# EAGLE design SONOFFPROG (EAGLE 9.4.0)
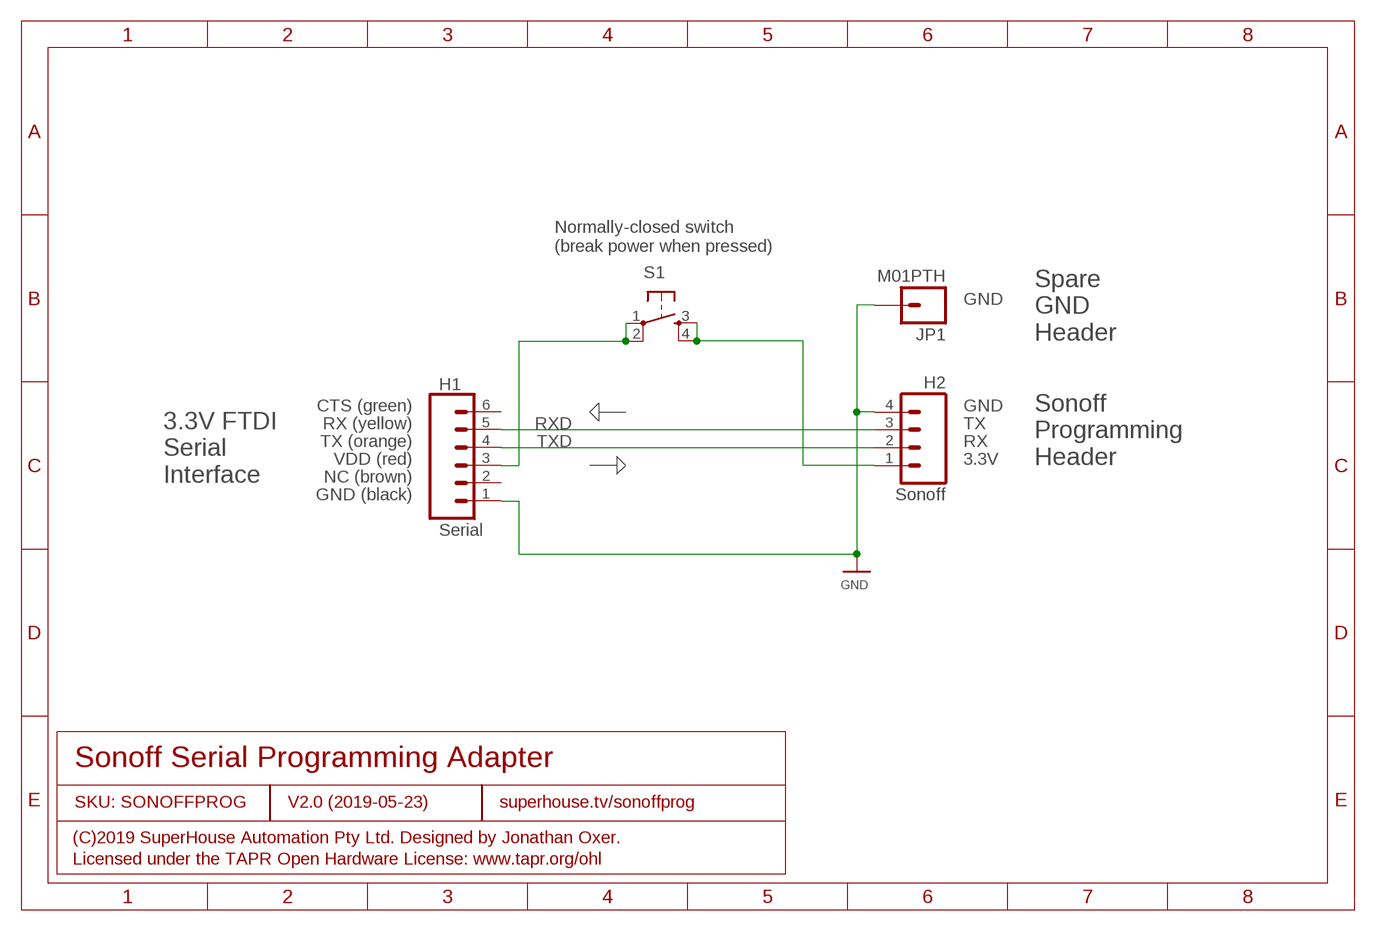
[diagram p0: schematic, sheet 1]

## Parts
H1  Serial  M06SIP  [1X06]
H2  Sonoff  M04PTH  [1X04]
JP1  M01PTH  [1X01]
S1  TAC_SWITCHPTH  [TACTILE-PTH]

## Nets
GND: H1.1 H2.4 JP1.1
N$1: H2.1 S1.3 S1.4
N$4: H1.3 S1.1 S1.2
RXD: H1.5 H2.3
TXD: H1.4 H2.2
Unconnected: H1.2 H1.6

## Notes on the sheet
- Normally-closed switch
  (break power when pressed)
- GND
- Spare
  GND
  Header
- CTS (green) | GND
- RX (yellow) | TX
- TX (orange) | RX
- VDD (red) | 3.3V
- Sonoff
  Programming
  Header
- 3.3V FTDI
  Serial
  Interface
- NC (brown)
- GND (black)
- Sonoff Serial Programming Adapter
- SKU: SONOFFPROG | V2.0 (2019-05-23) | superhouse.tv/sonoffprog
- (C)2019 SuperHouse Automation Pty Ltd. Designed by Jonathan Oxer.
- Licensed under the TAPR Open Hardware License: www.tapr.org/ohl

## Library data of the parts
H1 = freetronics-master-v1:M06: Header 6 Standard 6-pin 0.1" header. Use with straight break away headers (SKU : PRT-00116), right angle break away headers (PRT-00553), swiss pins (PRT-00743), machine pins (PRT-00117), and female headers (PRT-00115). Molex polarized connector foot print use with SKU : PRT-08094 with associated crimp pins and housings. NOTES ON THE VARIANTS LOCK and LOCK_LONGPADS... This footprint was designed to help hold the alignment of a through-hole component (i.e. 6-pin header) while soldering it into place. You may notice that each hole has been shifted either up or down by 0.005 of an inch from it's more standard position (which is a perfectly straight line). This slight alteration caused the pins (the squares in the middle) to touch the edges of the holes. Because they are alternating, it causes a "brace" to hold the component in place. 0.005 has proven to be the perfect amount of "off-center" position when using our standard breakaway headers. Although looks a little odd when you look at the bare footprint, once you have a header in there, the alteration is very hard to notice. Also, if you push a header all the way into place, it is covered up entirely on the bottom side. This idea of altering the position of holes to aid alignment will be further integrated into the Sparkfun Library for other footprints. It can help hold any component with 3 or more connection pins.
H2 = freetronics-jon:M04: Header 4 Standard 4-pin 0.1" header. Use with straight break away headers (SKU : PRT-00116), right angle break away headers (PRT-00553), swiss pins (PRT-00743), machine pins (PRT-00117), and female headers (PRT-00115). Molex polarized connector foot print use with SKU : PRT-08231 with associated crimp pins and housings. 1MM SMD Version SKU: PRT-10208
JP1 = freetronics-original:M01: Header 1 Standard 1-pin 0.1" header. Use with straight break away headers (SKU : PRT-00116), right angle break away headers (PRT-00553), swiss pins (PRT-00743), machine pins (PRT-00117), and female headers (PRT-00115).
S1 = freetronics-original:TAC_SWITCH: Momentary Switch Button commonly used for reset or general input. Spark Fun Electronics SKU : COM-00097

## Net classes
0 default: width 0.152 mm, drill 0.241 mm, clearance 0.152 mm

## Board
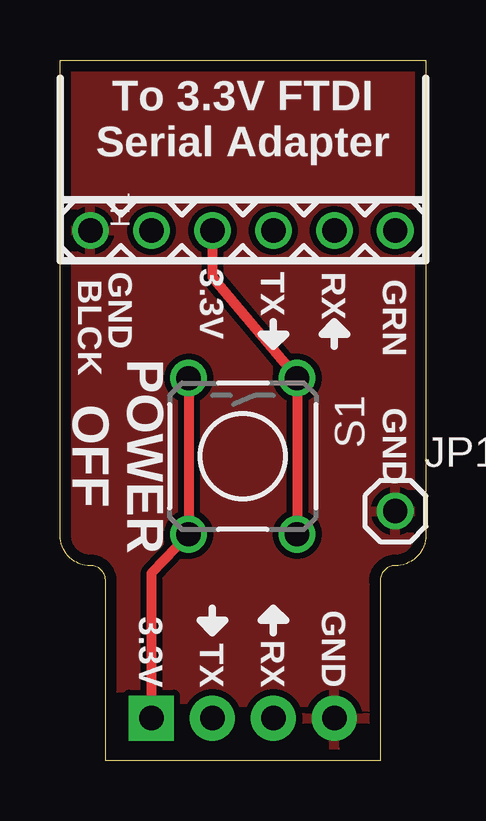
[diagram p1: board, top side]
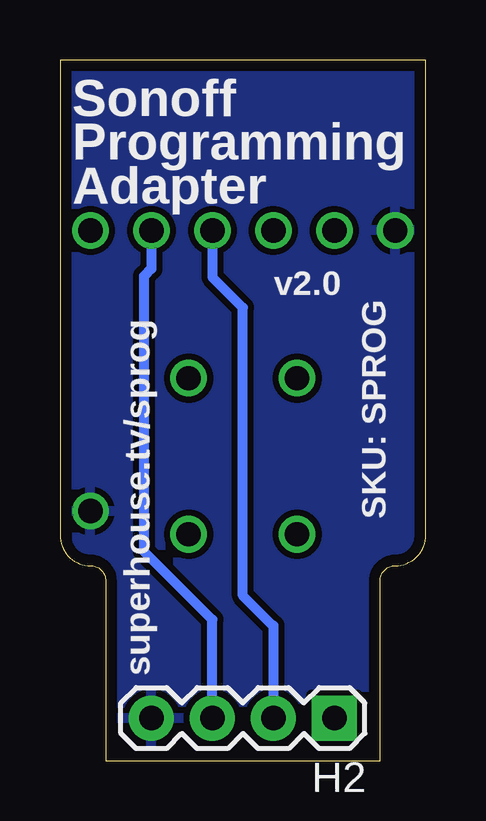
[diagram p2: board, bottom side, seen from below]

Size 15.24 x 29.2 mm. Coordinates in mm from the lower left corner, seen from the top.
Outline: 15.24,29.2 15.24,9.4 arc-90 13.97,8.13 arc90 13.34,7.49 13.34,0 1.91,0 1.91,7.49 arc90 1.27,8.13 arc-90 0,9.4 0,29.2 15.24,29.2
Copper layers (1*16): Top 0.035mm / dielectric 1.5mm / Bottom 0.035mm
Design rules "default": minimum track width 8mil, minimum drill 15mil, track to track 10mil, track to pad 10mil, pad to pad 10mil, via to via 10mil, smd to smd 8mil, copper to edge 18mil, drill to drill 8mil, minimum pad ring 10mil, minimum via ring 8mil, stop-mask expansion 4mil, vias tented up to drill 25mil, thermal gap 10mil

### Footprints (pad centres in the part's own frame; a part is rotated, then mirrored left to right if it is on the bottom)
1X06 = drill 1.016: 1 0,0; 2 2.54,0; 3 5.08,0; 4 7.62,0; 5 10.16,0; 6 12.7,0
1X04 = drill 1.016 pad 1.88 square: 1 0,0 | drill 1.016 pad 1.88: 2 2.54,0; 3 5.08,0; 4 7.62,0
1X01 = drill 1.016: 1 0,0
TACTILE-PTH = drill 1.016: 1 -3.251,2.261; 2 3.251,2.261; 3 -3.251,-2.261; 4 3.251,-2.261

### Placement (x,y rotation side)
H1  1.27,22.1 0 top
H2  3.81,1.78 180 bottom
JP1  13.97,10.4 0 top
S1  7.62,12.69 270 top

### Tracks (layer width: path | path; a pad name or v marks a point on that pad's centre or on a via)
GND
  pour Bottom: 15.24,29.2 15.24,-0.01 1.91,0 0,-0.01 0,29.2
  pour Top: 15.24,29.2 15.24,-0.01 1.91,0 0,-0.01 0,29.2
N$1
  Top 0.406: S1.3 S1.4 3.81,7.81 H2.1
N$4
  Top 0.406: H1.3 6.35,20.15 S1.1 S1.2
RXD
  Bottom 0.406: H1.5 11.43,20.5 11.73,20.2 11.73,8.72 8.89,5.88 H2.3
TXD
  Bottom 0.305: 6.35,5.63 6.37,5.63
  Bottom 0.406: 6.35,5.63 H2.2 | H1.4 8.89,20.15 7.62,18.88 7.62,6.88 6.37,5.63

### Text on the board
tPlace: To 3.3V FTDI / Serial Adapter | 3.3V | BLCK | GND | TX | RX | GRN | GND | POWER / OFF | 3.3V | TX | RX | GND
bPlace: Sonoff / Programming / Adapter | v2.0 | SKU: SPROG | superhouse.tv/sprog